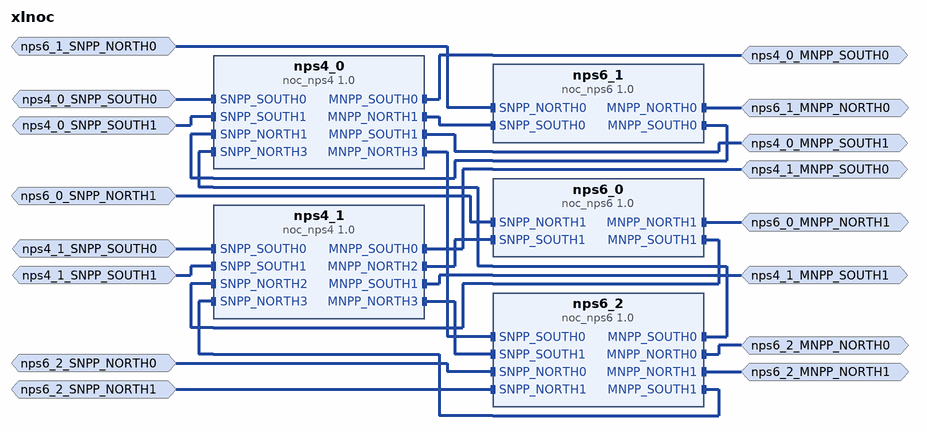
[diagram p0: block diagram of the top level]
# Vivado block design xlnoc, xcvh1582-vsva3697-2MP-e-S, Vivado 2024.2
create_bd_design xlnoc

create_bd_intf_port -mode Slave -vlnv xilinx.com:interface:npp_hbm_rtl:1.0 nps4_1_SNPP_SOUTH0
create_bd_intf_port -mode Master -vlnv xilinx.com:interface:npp_rtl:1.0 nps6_2_MNPP_NORTH0
create_bd_intf_port -mode Slave -vlnv xilinx.com:interface:npp_rtl:1.0 nps6_2_SNPP_NORTH0
create_bd_intf_port -mode Master -vlnv xilinx.com:interface:npp_hbm_rtl:1.0 nps4_1_MNPP_SOUTH0
create_bd_intf_port -mode Slave -vlnv xilinx.com:interface:npp_hbm_rtl:1.0 nps4_0_SNPP_SOUTH0
create_bd_intf_port -mode Master -vlnv xilinx.com:interface:npp_rtl:1.0 nps6_1_MNPP_NORTH0
create_bd_intf_port -mode Slave -vlnv xilinx.com:interface:npp_rtl:1.0 nps6_1_SNPP_NORTH0
create_bd_intf_port -mode Master -vlnv xilinx.com:interface:npp_hbm_rtl:1.0 nps4_0_MNPP_SOUTH0
create_bd_intf_port -mode Slave -vlnv xilinx.com:interface:npp_hbm_rtl:1.0 nps4_1_SNPP_SOUTH1
create_bd_intf_port -mode Master -vlnv xilinx.com:interface:npp_rtl:1.0 nps6_0_MNPP_NORTH1
create_bd_intf_port -mode Slave -vlnv xilinx.com:interface:npp_rtl:1.0 nps6_0_SNPP_NORTH1
create_bd_intf_port -mode Master -vlnv xilinx.com:interface:npp_hbm_rtl:1.0 nps4_1_MNPP_SOUTH1
create_bd_intf_port -mode Slave -vlnv xilinx.com:interface:npp_hbm_rtl:1.0 nps4_0_SNPP_SOUTH1
create_bd_intf_port -mode Master -vlnv xilinx.com:interface:npp_rtl:1.0 nps6_2_MNPP_NORTH1
create_bd_intf_port -mode Slave -vlnv xilinx.com:interface:npp_rtl:1.0 nps6_2_SNPP_NORTH1
create_bd_intf_port -mode Master -vlnv xilinx.com:interface:npp_hbm_rtl:1.0 nps4_0_MNPP_SOUTH1

create_bd_cell -type ip -vlnv xilinx.com:ip:noc_nps4:1.0 nps4_0
set_property -dict [list \
  CONFIG.USER_MNPP_NORTH0_PORT_EN FALSE \
  CONFIG.USER_MNPP_NORTH2_PORT_EN FALSE \
  CONFIG.USER_MNPP_SOUTH2_PORT_EN FALSE \
  CONFIG.USER_MNPP_SOUTH3_PORT_EN FALSE \
  CONFIG.USER_SNPP_NORTH0_PORT_EN FALSE \
  CONFIG.USER_SNPP_NORTH2_PORT_EN FALSE \
  CONFIG.USER_SNPP_SOUTH2_PORT_EN FALSE \
  CONFIG.USER_SNPP_SOUTH3_PORT_EN FALSE \
] [get_bd_cells nps4_0]
create_bd_cell -type ip -vlnv xilinx.com:ip:noc_nps4:1.0 nps4_1
set_property -dict [list \
  CONFIG.USER_MNPP_NORTH0_PORT_EN FALSE \
  CONFIG.USER_MNPP_NORTH1_PORT_EN FALSE \
  CONFIG.USER_MNPP_SOUTH2_PORT_EN FALSE \
  CONFIG.USER_MNPP_SOUTH3_PORT_EN FALSE \
  CONFIG.USER_SNPP_NORTH0_PORT_EN FALSE \
  CONFIG.USER_SNPP_NORTH1_PORT_EN FALSE \
  CONFIG.USER_SNPP_SOUTH2_PORT_EN FALSE \
  CONFIG.USER_SNPP_SOUTH3_PORT_EN FALSE \
] [get_bd_cells nps4_1]
create_bd_cell -type ip -vlnv xilinx.com:ip:noc_nps6:1.0 nps6_0
set_property -dict [list \
  CONFIG.USER_MNPP_EAST_PORT_EN FALSE \
  CONFIG.USER_MNPP_NORTH0_PORT_EN FALSE \
  CONFIG.USER_MNPP_SOUTH0_PORT_EN FALSE \
  CONFIG.USER_MNPP_WEST_PORT_EN FALSE \
  CONFIG.USER_SNPP_EAST_PORT_EN FALSE \
  CONFIG.USER_SNPP_NORTH0_PORT_EN FALSE \
  CONFIG.USER_SNPP_SOUTH0_PORT_EN FALSE \
  CONFIG.USER_SNPP_WEST_PORT_EN FALSE \
] [get_bd_cells nps6_0]
create_bd_cell -type ip -vlnv xilinx.com:ip:noc_nps6:1.0 nps6_1
set_property -dict [list \
  CONFIG.USER_MNPP_EAST_PORT_EN FALSE \
  CONFIG.USER_MNPP_NORTH1_PORT_EN FALSE \
  CONFIG.USER_MNPP_SOUTH1_PORT_EN FALSE \
  CONFIG.USER_MNPP_WEST_PORT_EN FALSE \
  CONFIG.USER_SNPP_EAST_PORT_EN FALSE \
  CONFIG.USER_SNPP_NORTH1_PORT_EN FALSE \
  CONFIG.USER_SNPP_SOUTH1_PORT_EN FALSE \
  CONFIG.USER_SNPP_WEST_PORT_EN FALSE \
] [get_bd_cells nps6_1]
create_bd_cell -type ip -vlnv xilinx.com:ip:noc_nps6:1.0 nps6_2
set_property -dict [list \
  CONFIG.USER_MNPP_EAST_PORT_EN FALSE \
  CONFIG.USER_MNPP_WEST_PORT_EN FALSE \
  CONFIG.USER_SNPP_EAST_PORT_EN FALSE \
  CONFIG.USER_SNPP_WEST_PORT_EN FALSE \
] [get_bd_cells nps6_2]

# ---- connections ----

connect_bd_intf_net [get_bd_intf_pins nps4_0/MNPP_NORTH1] [get_bd_intf_pins nps6_1/SNPP_SOUTH0]
connect_bd_intf_net [get_bd_intf_pins nps4_0/MNPP_NORTH3] [get_bd_intf_pins nps6_2/SNPP_SOUTH0]
connect_bd_intf_net [get_bd_intf_ports nps4_0_MNPP_SOUTH0] [get_bd_intf_pins nps4_0/MNPP_SOUTH0]
connect_bd_intf_net [get_bd_intf_ports nps4_0_MNPP_SOUTH1] [get_bd_intf_pins nps4_0/MNPP_SOUTH1]
connect_bd_intf_net -intf_net nps4_0_SNPP_SOUTH0_1 [get_bd_intf_ports nps4_0_SNPP_SOUTH0] [get_bd_intf_pins nps4_0/SNPP_SOUTH0]
connect_bd_intf_net -intf_net nps4_0_SNPP_SOUTH1_1 [get_bd_intf_ports nps4_0_SNPP_SOUTH1] [get_bd_intf_pins nps4_0/SNPP_SOUTH1]
connect_bd_intf_net [get_bd_intf_pins nps4_1/MNPP_NORTH2] [get_bd_intf_pins nps6_0/SNPP_SOUTH1]
connect_bd_intf_net [get_bd_intf_pins nps4_1/MNPP_NORTH3] [get_bd_intf_pins nps6_2/SNPP_SOUTH1]
connect_bd_intf_net [get_bd_intf_ports nps4_1_MNPP_SOUTH0] [get_bd_intf_pins nps4_1/MNPP_SOUTH0]
connect_bd_intf_net [get_bd_intf_ports nps4_1_MNPP_SOUTH1] [get_bd_intf_pins nps4_1/MNPP_SOUTH1]
connect_bd_intf_net -intf_net nps4_1_SNPP_SOUTH0_1 [get_bd_intf_ports nps4_1_SNPP_SOUTH0] [get_bd_intf_pins nps4_1/SNPP_SOUTH0]
connect_bd_intf_net -intf_net nps4_1_SNPP_SOUTH1_1 [get_bd_intf_ports nps4_1_SNPP_SOUTH1] [get_bd_intf_pins nps4_1/SNPP_SOUTH1]
connect_bd_intf_net [get_bd_intf_ports nps6_0_MNPP_NORTH1] [get_bd_intf_pins nps6_0/MNPP_NORTH1]
connect_bd_intf_net [get_bd_intf_pins nps6_0/MNPP_SOUTH1] [get_bd_intf_pins nps4_1/SNPP_NORTH2]
connect_bd_intf_net -intf_net nps6_0_SNPP_NORTH1_1 [get_bd_intf_ports nps6_0_SNPP_NORTH1] [get_bd_intf_pins nps6_0/SNPP_NORTH1]
connect_bd_intf_net [get_bd_intf_ports nps6_1_MNPP_NORTH0] [get_bd_intf_pins nps6_1/MNPP_NORTH0]
connect_bd_intf_net [get_bd_intf_pins nps6_1/MNPP_SOUTH0] [get_bd_intf_pins nps4_0/SNPP_NORTH1]
connect_bd_intf_net -intf_net nps6_1_SNPP_NORTH0_1 [get_bd_intf_ports nps6_1_SNPP_NORTH0] [get_bd_intf_pins nps6_1/SNPP_NORTH0]
connect_bd_intf_net [get_bd_intf_ports nps6_2_MNPP_NORTH0] [get_bd_intf_pins nps6_2/MNPP_NORTH0]
connect_bd_intf_net [get_bd_intf_ports nps6_2_MNPP_NORTH1] [get_bd_intf_pins nps6_2/MNPP_NORTH1]
connect_bd_intf_net [get_bd_intf_pins nps6_2/MNPP_SOUTH0] [get_bd_intf_pins nps4_0/SNPP_NORTH3]
connect_bd_intf_net [get_bd_intf_pins nps6_2/MNPP_SOUTH1] [get_bd_intf_pins nps4_1/SNPP_NORTH3]
connect_bd_intf_net -intf_net nps6_2_SNPP_NORTH0_1 [get_bd_intf_ports nps6_2_SNPP_NORTH0] [get_bd_intf_pins nps6_2/SNPP_NORTH0]
connect_bd_intf_net -intf_net nps6_2_SNPP_NORTH1_1 [get_bd_intf_ports nps6_2_SNPP_NORTH1] [get_bd_intf_pins nps6_2/SNPP_NORTH1]

validate_bd_design
save_bd_design
